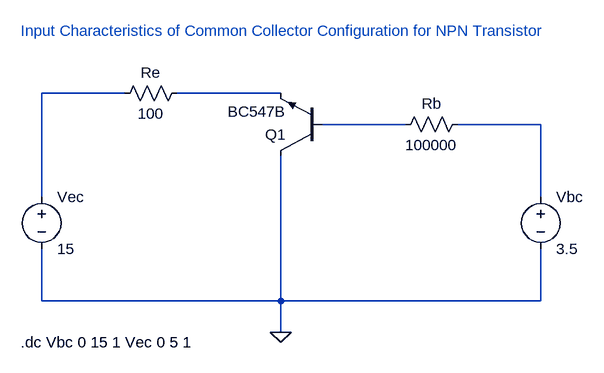
[diagram p0: schematic Assignment 5b (i).asc]
Assignment 5b (i).asc, the LTspice schematic file:
Version 4.1
SHEET 1 880 680
WIRE -32 64 -160 64
WIRE 208 64 48 64
WIRE 400 112 272 112
WIRE 608 112 480 112
WIRE -160 224 -160 64
WIRE 608 224 608 112
WIRE -160 384 -160 304
WIRE 208 384 208 160
WIRE 208 384 -160 384
WIRE 608 384 608 304
WIRE 608 384 208 384
WIRE 208 432 208 384
FLAG 208 432 0
SYMBOL npn 272 160 R180
SYMATTR InstName Q1
SYMATTR Value BC547B
SYMBOL res 496 96 R90
WINDOW 0 0 56 VBottom 2
WINDOW 3 32 56 VTop 2
SYMATTR InstName Rb
SYMATTR Value 100000
SYMBOL res 64 48 R90
WINDOW 0 0 56 VBottom 2
WINDOW 3 32 56 VTop 2
SYMATTR InstName Re
SYMATTR Value 100
SYMBOL voltage -160 208 R0
WINDOW 123 0 0 Left 0
WINDOW 39 0 0 Left 0
SYMATTR InstName Vec
SYMATTR Value 15
SYMBOL voltage 608 208 R0
WINDOW 123 0 0 Left 0
WINDOW 39 0 0 Left 0
SYMATTR InstName Vbc
SYMATTR Value 3.5
TEXT -192 -32 Left 2 ;Input Characteristics of Common Collector Configuration for NPN Transistor
TEXT -192 448 Left 2 !.dc Vbc 0 15 1 Vec 0 5 1

The netlist it stands for:
* Assignment 5b (i).asc
Q1 0 N003 N002 0 BC547B
Rb N004 N003 100000
Re N002 N001 100
Vec N001 0 15
Vbc N004 0 3.5
.model NPN NPN
.model PNP PNP
.lib standard.bjt
* Input Characteristics of Common Collector Configuration for NPN Transistor
.dc Vbc 0 15 1 Vec 0 5 1
.backanno
.end